# Altium schematic sheet 08_LLC_Temperature.SchDoc
size A4; DocumentNumber: 8; SheetNumber: 7; SheetTotal: 8
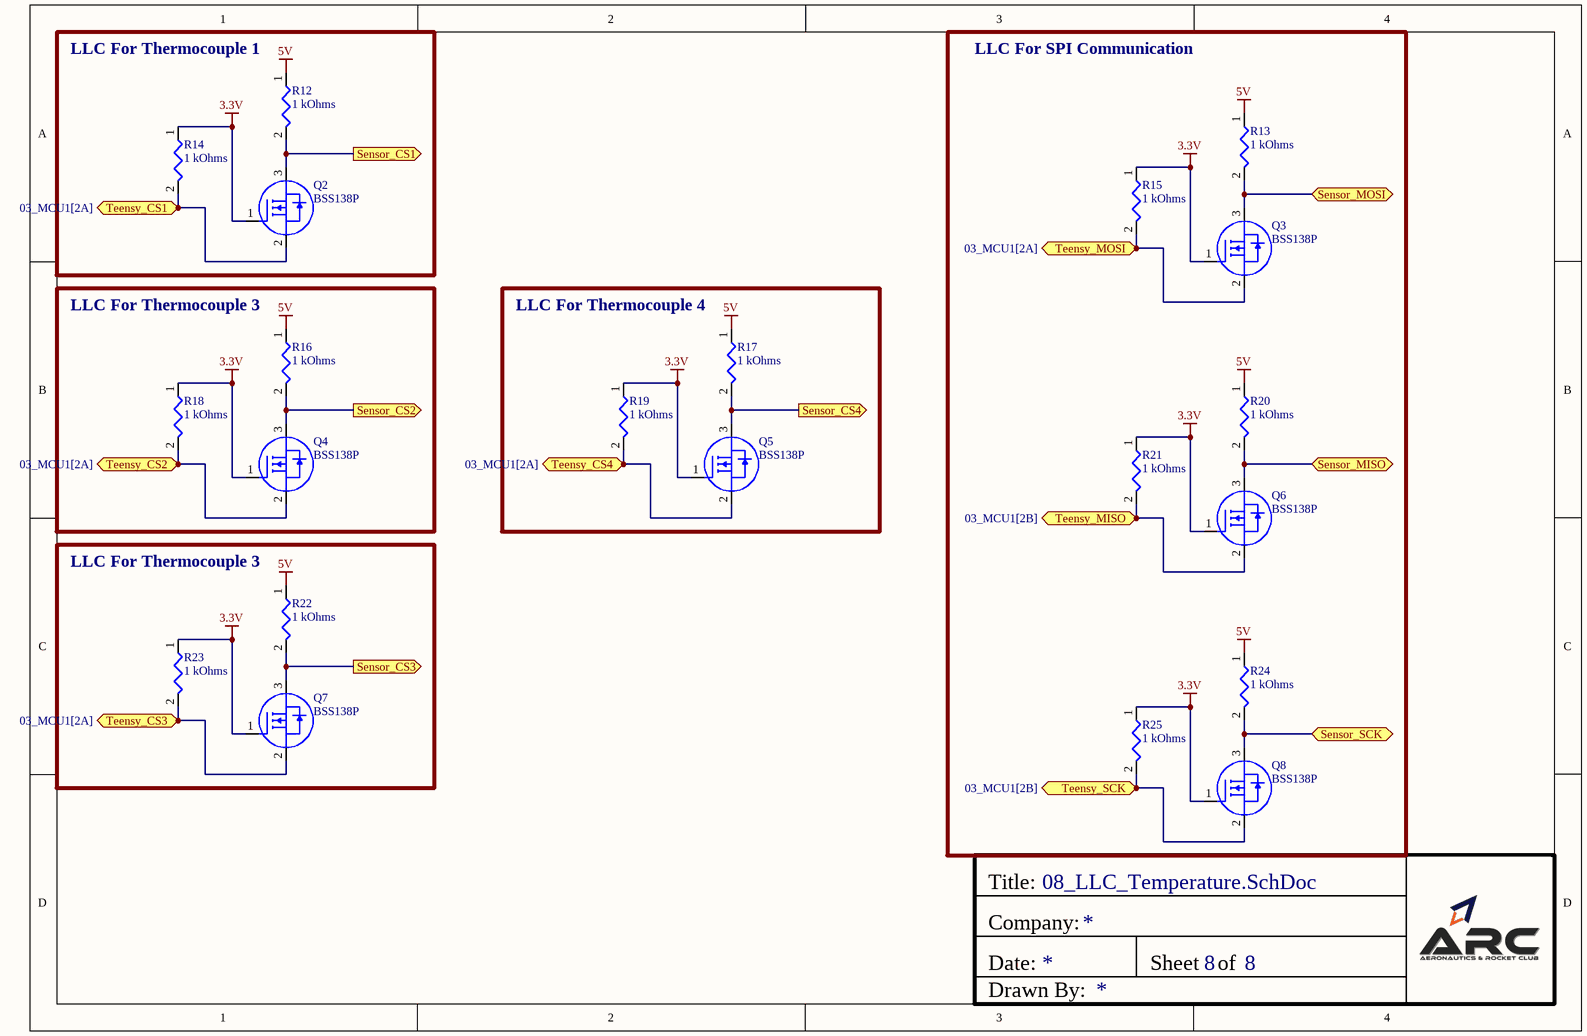
[diagram p0: 08_LLC_Temperature.SchDoc]

## Parts
Q2  BSS138P  [BSS138P]
Q3  BSS138P  [BSS138P]
Q4  BSS138P  [BSS138P]
Q5  BSS138P  [BSS138P]
Q6  BSS138P  [BSS138P]
Q7  BSS138P  [BSS138P]
Q8  BSS138P  [BSS138P]
R12  1 kOhms  [RESC2012X06N]
R13  1 kOhms  [RESC2012X06N]
R14  1 kOhms  [RESC2012X06N]
R15  1 kOhms  [RESC2012X06N]
R16  1 kOhms  [RESC2012X06N]
R17  1 kOhms  [RESC2012X06N]
R18  1 kOhms  [RESC2012X06N]
R19  1 kOhms  [RESC2012X06N]
R20  1 kOhms  [RESC2012X06N]
R21  1 kOhms  [RESC2012X06N]
R22  1 kOhms  [RESC2012X06N]
R23  1 kOhms  [RESC2012X06N]
R24  1 kOhms  [RESC2012X06N]
R25  1 kOhms  [RESC2012X06N]

## Blocks framed on the sheet
LLC For Thermocouple 1: Q2 R12 R14
LLC For SPI Communication: Q3 Q6 Q8 R13 R15 R20 R21 R24 R25
LLC For Thermocouple 3: Q4 R16 R18
LLC For Thermocouple 4: Q5 R17 R19
LLC For Thermocouple 3: Q7 R22 R23

## Ports
Sensor_CS1 (out, see 04_Temperature[1A]), Sensor_CS2 (out, see 04_Temperature[1B]), Sensor_CS3 (out, see 04_Temperature[1C]), Sensor_CS4 (out, see 04_Temperature[3B]), Sensor_MISO (bidir, see 04_Temperature[1A], 04_Temperature[1B], 04_Temperature[1C], 04_Temperature[3B]), Sensor_MOSI (bidir, see 04_Temperature[1A], 04_Temperature[1B], 04_Temperature[1C], 04_Temperature[3B]), Sensor_SCK (bidir, see 04_Temperature[1A], 04_Temperature[1B], 04_Temperature[1D], 04_Temperature[3B], 05_Pressure_and_LoadCell[3B]), Teensy_CS1 (bidir, see 03_MCU1[2A]), Teensy_CS2 (bidir, see 03_MCU1[2A]), Teensy_CS3 (bidir, see 03_MCU1[2A]), Teensy_CS4 (bidir, see 03_MCU1[2A]), Teensy_MISO (bidir, see 03_MCU1[2B]), Teensy_MOSI (bidir, see 03_MCU1[2A]), Teensy_SCK (bidir, see 03_MCU1[2B])

## Nets
3.3V: Q2.1(G) Q3.1(G) Q4.1(G) Q5.1(G) Q6.1(G) Q7.1(G) Q8.1(G) R14.1 R15.1 R18.1 R19.1 R21.1 R23.1 R25.1
5V: R12.1 R13.1 R16.1 R17.1 R20.1 R22.1 R24.1
Sensor_CS1: Q2.3(D) R12.2 ; port Sensor_CS1
Sensor_CS2: Q4.3(D) R16.2 ; port Sensor_CS2
Sensor_CS3: Q7.3(D) R22.2 ; port Sensor_CS3
Sensor_CS4: Q5.3(D) R17.2 ; port Sensor_CS4
Sensor_MISO: Q6.3(D) R20.2 ; port Sensor_MISO
Sensor_MOSI: Q3.3(D) R13.2 ; port Sensor_MOSI
Sensor_SCK: Q8.3(D) R24.2 ; port Sensor_SCK
Teensy_CS1: Q2.2(S) R14.2 ; port Teensy_CS1
Teensy_CS2: Q4.2(S) R18.2 ; port Teensy_CS2
Teensy_CS3: Q7.2(S) R23.2 ; port Teensy_CS3
Teensy_CS4: Q5.2(S) R19.2 ; port Teensy_CS4
Teensy_MISO: Q6.2(S) R21.2 ; port Teensy_MISO
Teensy_MOSI: Q3.2(S) R15.2 ; port Teensy_MOSI
Teensy_SCK: Q8.2(S) R25.2 ; port Teensy_SCK

## Notes on the sheet
- Title:
- Company:
- Date:
- Sheet
- of
- Drawn By:

## Library data of the parts
Q2-Q8 = BSS138P: N-Channel MOSFET BSS138P Series 60 V 1.6 Ohm 350 mW 0.72 nC SMT TrenchMOS FET - SOT-23; Manufacturer: Nexperia; Manufacturer Part Number: BSS138P,215; Supplier 1: Mouser; RoHS: Yes; Category: MOSFETs; Stock 1: 26596; Pricing 1: 1=0.27000, 10=0.22200, 50=0.22200, 100=0.11800, 500=0.07800, 1000=0.05300, 3000=0.04500, 10000=0.04500 (USD); RoHS Compliant: Yes; ComponentLink1URL: http://www.farnell.com/datasheets/923164.pdf?src-supplier=Farnell; ComponentLink1Description: http://www.farnell.com/datasheets/923164.pdf?src-supplier=Farnell; ComponentLink2URL: https://www.mouser.com/ds/2/302/BSS138P-114022.pdf?src-supplier=Mouser; ComponentLink2Description: https://www.mouser.com/ds/2/302/BSS138P-114022.pdf?src-supplier=Mouser; ComponentLink3URL: https://assets.nexperia.com/documents/data-sheet/BSS138P.pdf?src-supplier=Digi-Key; ComponentLink3Description: https://assets.nexperia.com/documents/data-sheet/BSS138P.pdf?src-supplier=Digi-Key; ComponentLink4URL: http://www.farnell.com/datasheets/923164.pdf?src-supplier=Newark; ComponentLink4Description: http://www.farnell.com/datasheets/923164.pdf?src-supplier=Newark; Supplier Part Number 1: 771-BSS138P215
R12-R25 = RC0805FR-7W1KL Yageo: 1 kOhms ±1% 0.25W, 1/4W Chip Resistor 0805 (2012 Metric) Moisture Resistant Thick Film; Manufacturer: Yageo; Value: 1kR; Supplier 1: Digi-Key; Manufacturer Part Number: RC0805FR-7W1KL; RoHS: Yes; Category: Chip SMD Resistors; Stock 1: 15000; Pricing 1: 5000=0.01838, 10000=0.01715, 25000=0.01629, 50000=0.01596, 125000=0.01562 (USD); Case/Package: 0805; Tolerance: 1%; RoHS Compliant: Yes; Supplier Part Number 1: 13-RC0805FR-7W1KLTR-ND